# EasyEDA schematic schematic.json
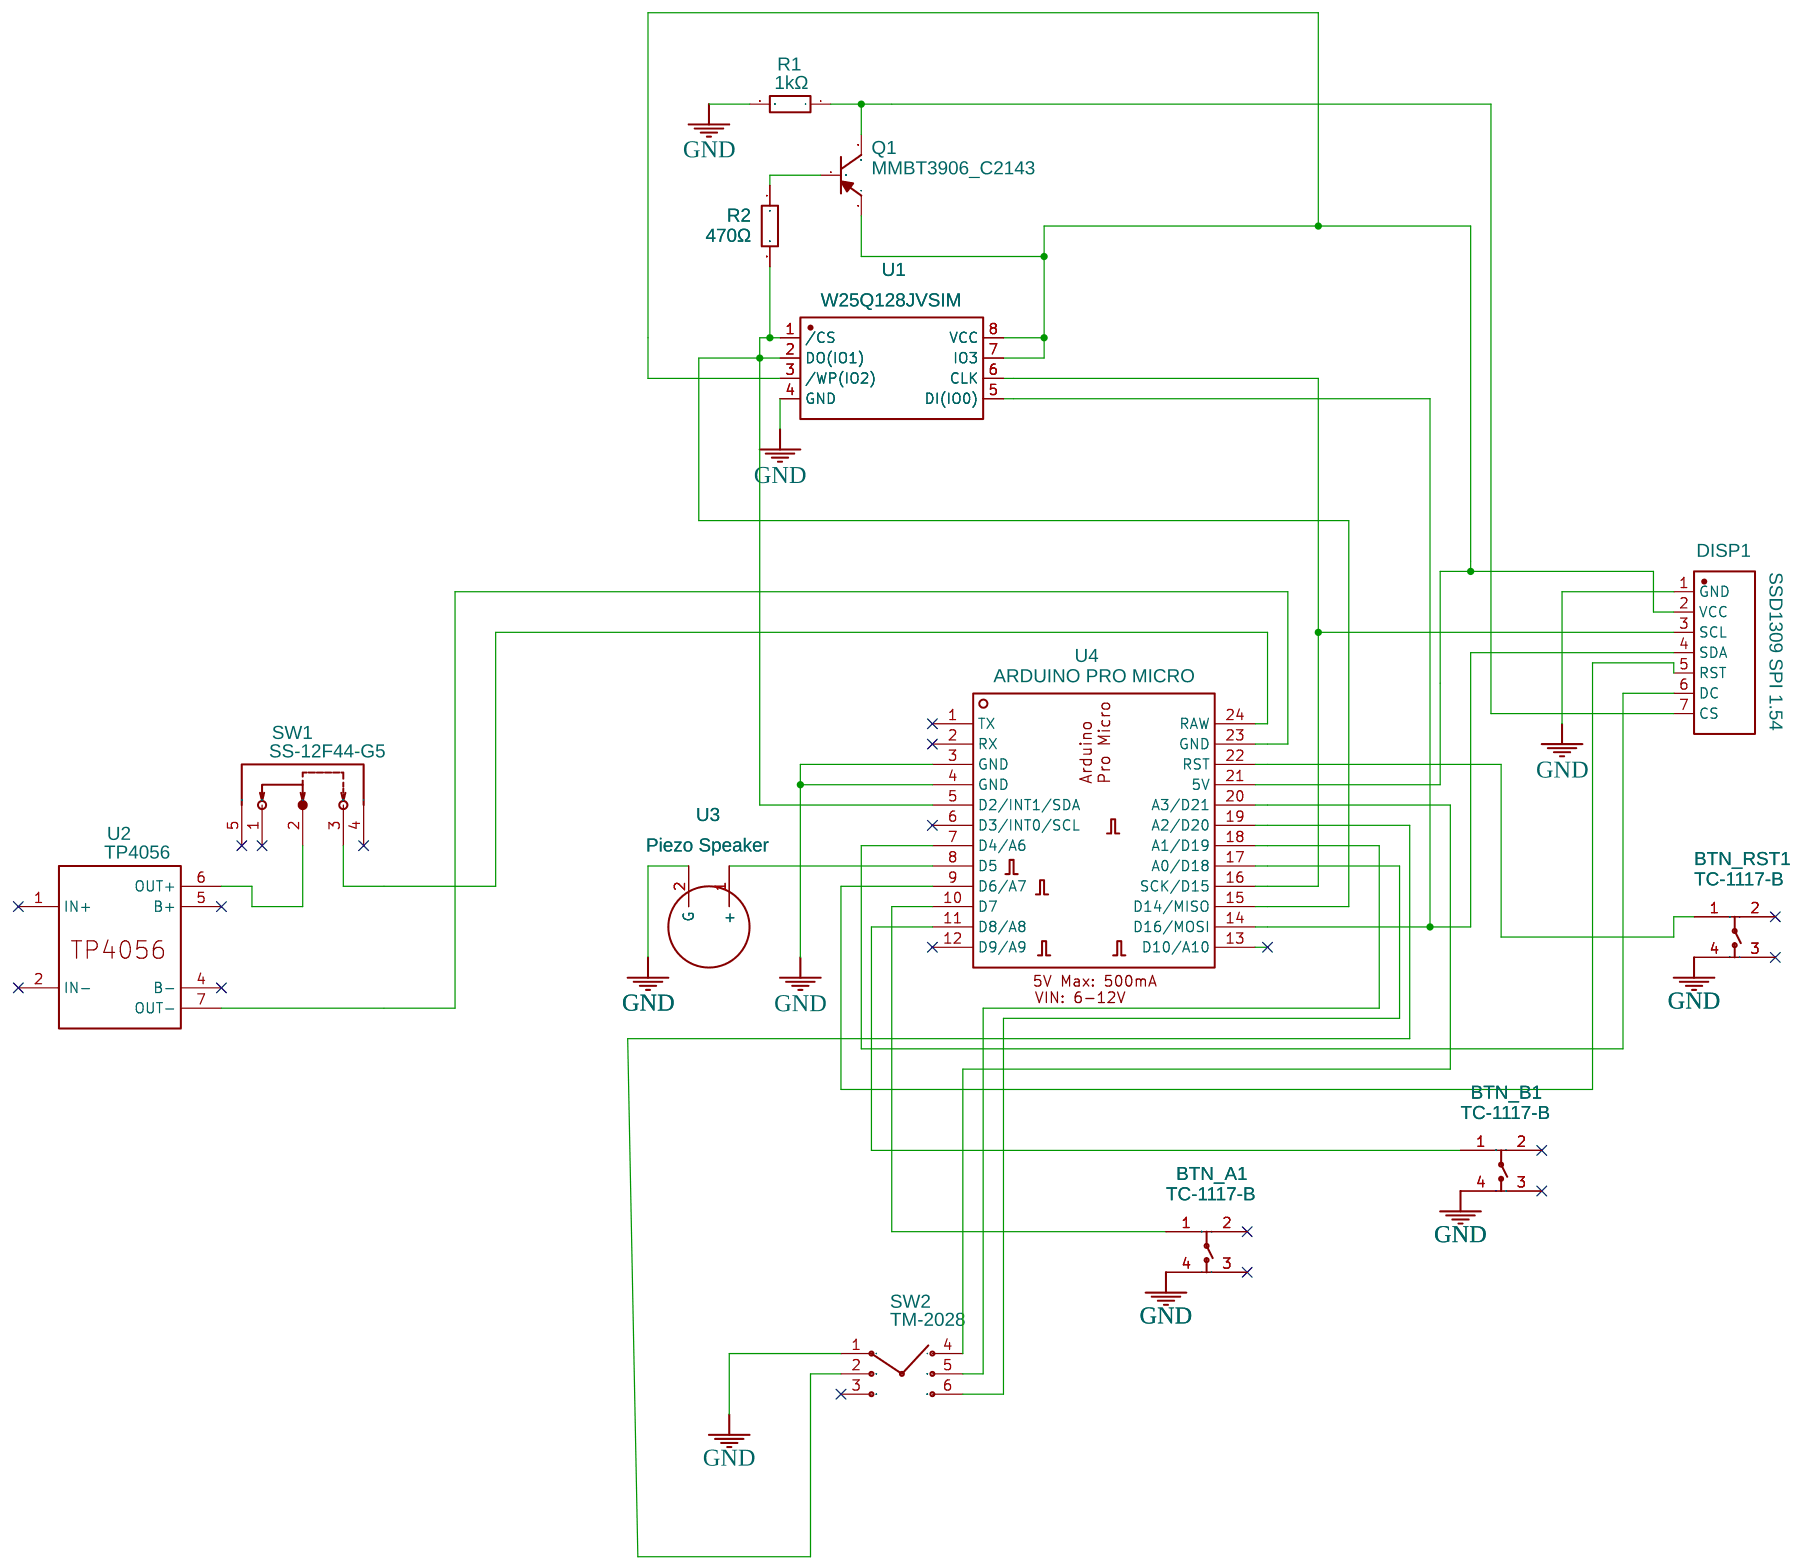
[diagram p0: schematic sheet]

## Parts
BTN_A1  TC-1117-B  [SW-TH_4P-L7.8-W7.8-P4.50-LS8.5]
BTN_B1  TC-1117-B  [SW-TH_4P-L7.8-W7.8-P4.50-LS8.5]
BTN_RST1  TC-1117-B  [SW-TH_4P-L7.8-W7.8-P4.50-LS8.5]
DISP1  SSD1309 SPI 1.54  [1.54 I2C OLED SSD1309]
Q1  MMBT3906_C2143  [SOT-23-3_L2.9-W1.3-P1.90-LS2.4-BR]
R1  1kΩ  [R0805]
R2  470Ω  [R0805]
SW1  SS-12F44-G5  [SW-TH_SS-12F44-G5]
SW2  TM-2028  [SW-TH_XKB_TM-2028]
U1  W25Q128JVSIM  [SOIC-8_L5.2-W5.2-P1.27-LS7.9-BL]
U2  TP4056  [TP4056]
U3  Piezo Speaker  [PIEZO_SPEAKER]
U4  ARDUINO PRO MICRO  [ARDUINOPROMICROUSB]

## Library data of the parts
BTN_A1 BTN_B1 BTN_RST1 = TC-1117-B: Contributor: LCSC; Supplier: LCSC; Supplier Part: C692475; Manufacturer: XKB Connectivity(中国星坤); JLCPCB Part Class: Extended Part
DISP1 = SSD1309 SPI 1.54: Contributor: cheungbx
Q1 = MMBT3906_C2143: Supplier: LCSC; Manufacturer: CJ(江苏长电/长晶); Manufacturer Part: MMBT3906 2A; Supplier Part: C2143; JLCPCB Part Class: Extended Part
R1 = RC0805FR-071KL: Supplier: LCSC; Manufacturer: YAGEO(国巨); Supplier Part: C95781; JLCPCB Part Class: Extended Part
R2 = RC0805FR-07470RL: Supplier: LCSC; Manufacturer: YAGEO(国巨); Supplier Part: C114564; JLCPCB Part Class: Extended Part
SW1 = SS-12F44-G5: Contributor: LCSC; Supplier: LCSC; Supplier Part: C136718; Manufacturer: 韩国韩荣; JLCPCB Part Class: Extended Part
SW2 = TM-2028: Contributor: LCSC; Supplier: LCSC; Supplier Part: C2884924; Manufacturer: XKB Connection(中国星坤); JLCPCB Part Class: Extended Part
U1 = W25Q128JVSIM: Supplier: LCSC; Supplier Part: C2613930; Manufacturer: WINBOND(华邦); JLCPCB Part Class: Extended Part; Contributor: sunilkumarack2
U2 = TP4056 COPY: Manufacturer Part: 1198156; link: https://www.banggood.com/5Pcs-Micro-USB-TP4056-Charge-And-Discharge-Protection-Module-Over-Current-Over-Voltage-Protection-p-1198156.html?rmmds=search; Contributor: Bestiada Nessuno; Supplier Part: 1198156; Supplier: Banggood; Manufacturer: Banggood
U3 = Piezo Speaker: Contributor: kevinlike
U4 = ARDUINO PRO MICRO: Contributor: laurent.mas

## Nets
GND: BTN_A1.4 BTN_B1.4 BTN_RST1.4 DISP1.1(GND) R1.2 SW2.1 U1.4(GND) U3.2(G) U4.3(GND) U4.4(GND)
Net-(BTN_A1-1): BTN_A1.1 U4.10(D7)
Net-(BTN_B1-1): BTN_B1.1 U4.11(D8/A8)
Net-(BTN_RST1-1): BTN_RST1.1 U4.22(RST)
Net-(DISP1-2): DISP1.2(VCC) Q1.2(E) U1.3(/WP(IO2)) U1.7(IO3) U1.8(VCC) U4.21(5V)
Net-(DISP1-3): DISP1.3(SCL) U1.6(CLK) U4.16(SCK/D15)
Net-(DISP1-4): DISP1.4(SDA) U1.5(DI(IO0)) U4.14(D16/MOSI)
Net-(DISP1-5): DISP1.5(RST) U4.9(D6/A7)
Net-(DISP1-6): DISP1.6(DC) U4.7(D4/A6)
Net-(DISP1-7): DISP1.7(CS) Q1.3(C) R1.1
Net-(Q1-1): Q1.1(B) R2.1
Net-(R2-2): R2.2 U1.1(/CS) U1.2(DO(IO1)) U4.5(D2/INT1/SDA) U4.15(D14/MISO)
Net-(SW1-2): SW1.2 U2.6(OUT+)
Net-(SW1-3): SW1.3 U4.24(RAW)
Net-(SW2-2): SW2.2 U4.19(A2/D20)
Net-(SW2-4): SW2.4 U4.20(A3/D21)
Net-(SW2-5): SW2.5 U4.18(A1/D19)
Net-(SW2-6): SW2.6 U4.17(A0/D18)
Net-(U2-7): U2.7(OUT-) U4.23(GND)
Net-(U3-1): U3.1(+) U4.8(D5)

Not connected (* = marked no-connect by the designer): BTN_A1 2* 3*; BTN_B1 2* 3*; BTN_RST1 2* 3*; SW1 1* 4* 5*; SW2 3*; U2 1(IN+)* 2(IN-)* 4(B-)* 5(B+)*; U4 1(TX)* 2(RX)* 6(D3/INT0/SCL)* 12(D9/A9)* 13(D10/A10)
